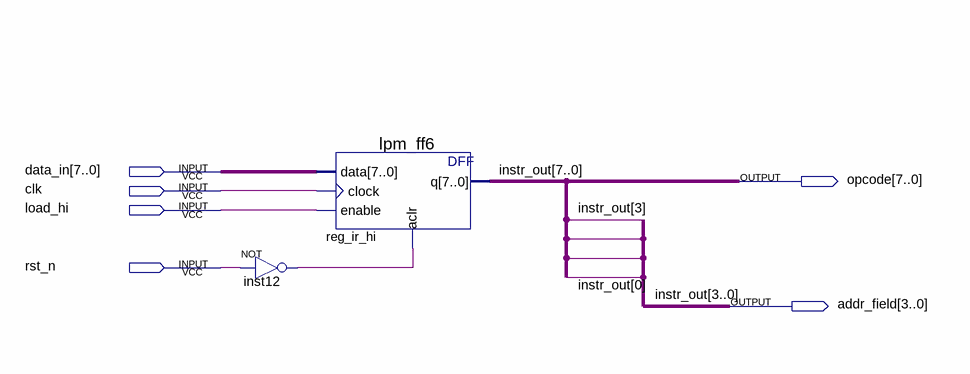
[diagram p0: schematic sheet]
// Quartus schematic ir_unit.bdf as structural Verilog: 2 symbols, 6 pins
module ir_unit (
  input  [7:0] data_in,
  input  clk,
  input  load_hi,
  input  rst_n,
  output [7:0] opcode,
  output [3:0] addr_field
);

  wire inst12_out;

  not inst12 (inst12_out, rst_n);
  lpm_ff6 reg_ir_hi (.data(data_in), .clock(clk), .enable(load_hi), .aclr(inst12_out), .q({opcode[7:4], addr_field}));

  assign opcode[3:0] = addr_field;

  // Other names for the same wires on the sheet: instr_out[7:0] = {opcode[7:4], addr_field}
endmodule
